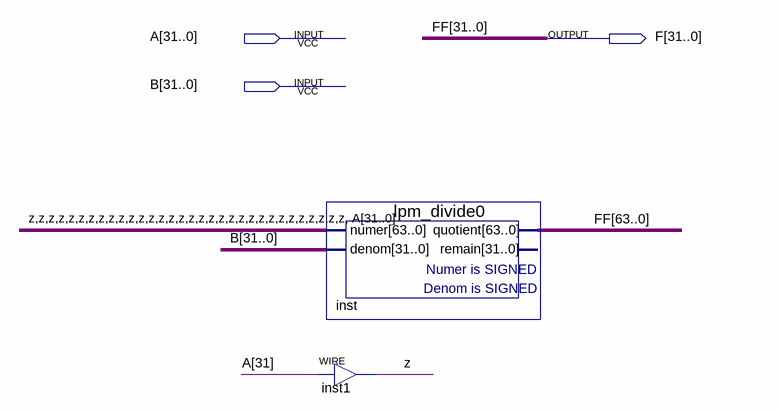
[diagram p0: schematic sheet]
// Quartus schematic real_div_int.bdf as structural Verilog: 2 symbols, 3 pins
module real_div_int (
  input  [31:0] A,
  input  [31:0] B,
  output [31:0] F
);

  wire z;
  wire [63:32] FF;

  lpm_divide0 inst (.numer({{32{z}}, A}), .denom(B), .quotient({FF, F}));  // open: remain
  assign z = A[31];  // WIRE inst1

  // Other names for the same wires on the sheet: FF[31:0] = F
endmodule
